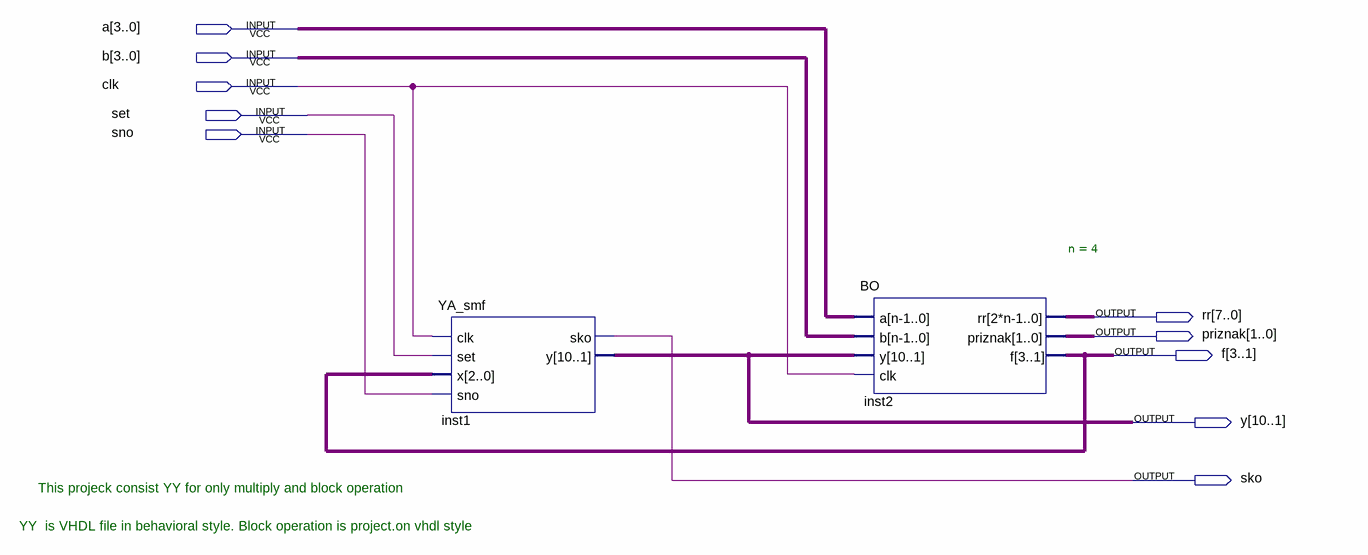
[diagram p0: schematic sheet]
// Quartus schematic alu_sm.bdf as structural Verilog: 2 symbols, 10 pins
module alu_sm (
  input  [3:0] a,
  input  [3:0] b,
  input  clk,
  input  set,
  input  sno,
  output [7:0] rr,
  output [1:0] priznak,
  output [3:1] f,
  output [10:1] y,
  output sko
);

  YA_smf inst1 (.clk(clk), .set(set), .x(f), .sno(sno), .sko(sko), .y(y));
  BO #(.n(4)) inst2 (.a(a), .b(b), .y(y), .clk(clk), .rr(rr), .priznak(priznak), .f(f));

  // Notes on the sheet:
  //   This projeck consist YY for only multiply and block operation
  //   YY  is VHDL file in behavioral style. Block operation is project.on vhdl style
endmodule
